# Altium project BSPD.PrjPcb
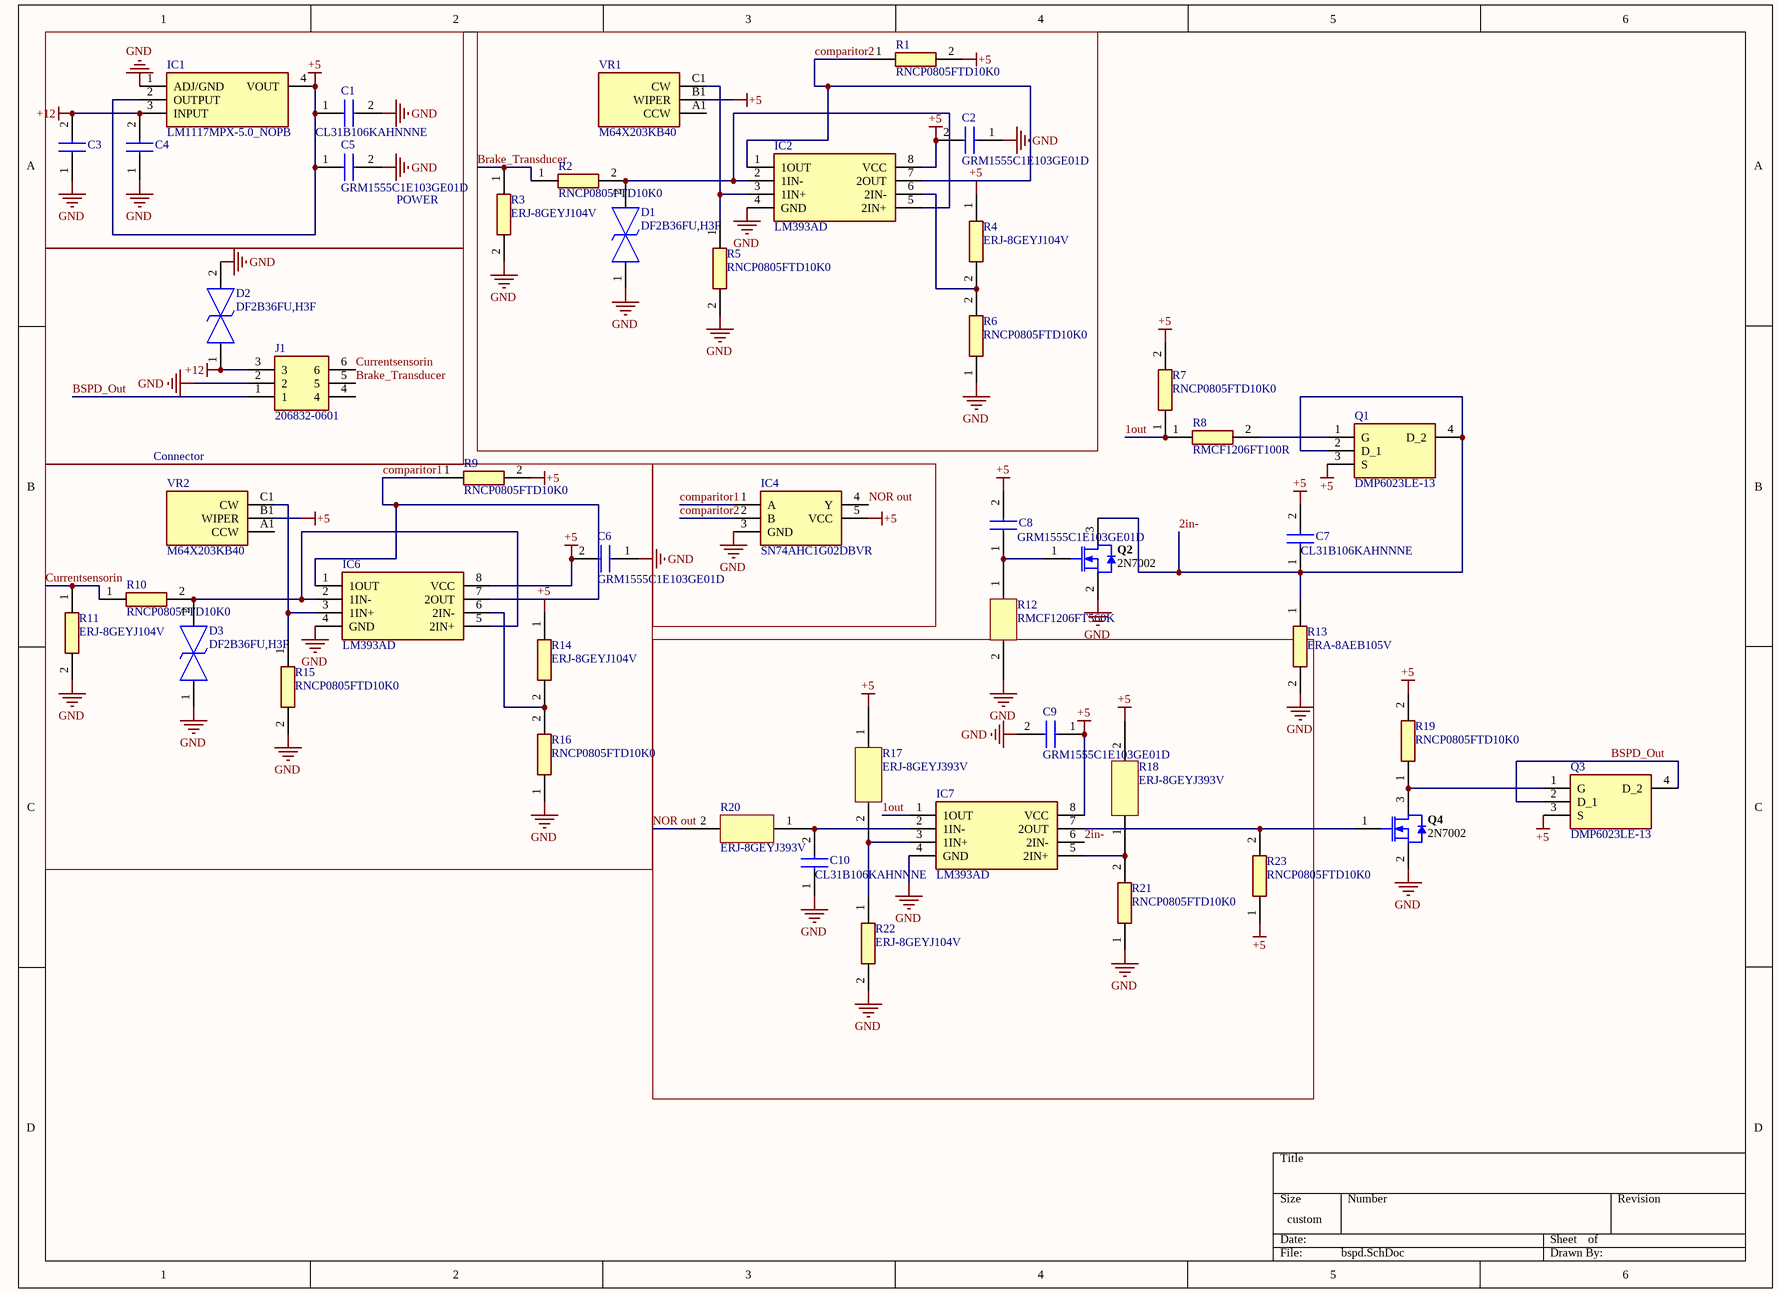
[diagram p0: bspd.SchDoc]
1 sheet, 48 parts. Net scope: global (net labels, ports and power ports of the same name join across sheets).
Board file: BSPD.PcbDoc

## Sheet bspd.SchDoc
size 330 x 241 mm; SheetNumber: 1; SheetTotal: 1

### Parts
C1  CL31B106KAHNNNE  [CAPC3216X180N]
C2  GRM1555C1E103GE01D  [CAPC1005X55N]
C3  CL31B106KAHNNNE  [CAPC3216X180N]  (value not drawn)
C4  GRM1555C1E103GE01D  [CAPC1005X55N]  (value not drawn)
C5  GRM1555C1E103GE01D  [CAPC1005X55N]
C6  GRM1555C1E103GE01D  [CAPC1005X55N]
C7  CL31B106KAHNNNE  [CAPC3216X180N]
C8  GRM1555C1E103GE01D  [CAPC1005X55N]
C9  GRM1555C1E103GE01D  [CAPC1005X55N]
C10  CL31B106KAHNNNE  [CAPC3216X180N]
D1  DF2B36FU,H3F  [1SS357TPH3F]
D2  DF2B36FU,H3F  [1SS357TPH3F]
D3  DF2B36FU,H3F  [1SS357TPH3F]
IC1  LM1117MPX-5.0_NOPB  [SOT230P700X180-4N]
IC2  LM393AD  [SOIC127P600X175-8N]
IC4  SN74AHC1G02DBVR  [SOT95P280X145-5N]
IC6  LM393AD  [SOIC127P600X175-8N]
IC7  LM393AD  [SOIC127P600X175-8N]
J1  206832-0601  [2068320601]
Q1  DMP6023LE-13  [SOT230P700X165-4N]
Q2  2N7002  [INF-PG-SOT23_M]
Q3  DMP6023LE-13  [SOT230P700X165-4N]
Q4  2N7002  [INF-PG-SOT23_M]
R1  RNCP0805FTD10K0  [RESC2012X65N]
R2  RNCP0805FTD10K0  [RESC2012X65N]
R3  ERJ-8GEYJ104V  [RESC3116X70N]
R4  ERJ-8GEYJ104V  [RESC3116X70N]
R5  RNCP0805FTD10K0  [RESC2012X65N]
R6  RNCP0805FTD10K0  [RESC2012X65N]
R7  RNCP0805FTD10K0  [RESC2012X65N]
R8  RMCF1206FT100R  [RESC3216X70N]
R9  RNCP0805FTD10K0  [RESC2012X65N]
R10  RNCP0805FTD10K0  [RESC2012X65N]
R11  ERJ-8GEYJ104V  [RESC3116X70N]
R12  RMCF1206FT560K  [RMCF1206FT560K]
R13  ERA-8AEB105V  [ERA8A_(0805)]
R14  ERJ-8GEYJ104V  [RESC3116X70N]
R15  RNCP0805FTD10K0  [RESC2012X65N]
R16  RNCP0805FTD10K0  [RESC2012X65N]
R17  ERJ-8GEYJ393V  [ERJ-8GEYJ393V]
R18  ERJ-8GEYJ393V  [ERJ-8GEYJ393V]
R19  RNCP0805FTD10K0  [RESC2012X65N]
R20  ERJ-8GEYJ393V  [ERJ-8GEYJ393V]
R21  RNCP0805FTD10K0  [RESC2012X65N]
R22  ERJ-8GEYJ104V  [RESC3116X70N]
R23  RNCP0805FTD10K0  [RESC2012X65N]
VR1  M64X203KB40  [M64X203KB40]
VR2  M64X203KB40  [M64X203KB40]

### Blocks framed on the sheet
POWER: C1 C3-C5 IC1
Connector: D2 J1

### Nets
+5: C1.1 C2.2 C5.1 C6.2 C7.2 C8.2 C9.1 IC1.2(OUTPUT) IC1.4(VOUT) IC2.8(VCC) IC4.5(VCC) IC6.8(VCC) IC7.8(VCC) Q1.3(S) Q3.3(S) R1.2 R4.1 R7.2 R9.2 R14.1 R17.1 R18.2 R19.2 R23.1 VR1.B1(WIPER) VR2.B1(WIPER)
+12: C3.2 C4.2 D2.1 IC1.3(INPUT) J1.3
GND: C1.2 C2.1 C3.1 C4.1 C5.2 C6.1 C9.2 C10.1 D1.1 D2.2 D3.1 IC1.1(ADJ/GND) IC2.4(GND) IC4.3(GND) IC6.4(GND) IC7.4(GND) J1.2 Q2.2(SOURCE) Q4.2(SOURCE) R3.2 R5.2 R6.1 R11.2 R12.2 R13.2 R15.2 R16.1 R21.1 R22.2
1out: IC7.1(1OUT) R7.1 R8.1
2in-: C7.1 IC7.6(2IN-) Q1.2(D_1) Q1.4(D_2) Q2.3(DRAIN) R13.1
Brake_Transducer: J1.5 R2.1 R3.1
BSPD_Out: J1.1 Q3.2(D_1) Q3.4(D_2)
comparitor1: IC4.1(A) IC6.1(1OUT) IC6.7(2OUT) R9.1
comparitor2: IC2.1(1OUT) IC2.7(2OUT) IC4.2(B) R1.1
Currentsensorin: J1.6 R10.1 R11.1
NOR out: IC4.4(Y) R20.2
NetC8_1: C8.1 Q2.1(GATE) R12.1
NetC10_2: C10.2 IC7.2(1IN-) R20.1
NetD1_2: D1.2 IC2.2(1IN-) IC2.5(2IN+) R2.2
NetD3_2: D3.2 IC6.2(1IN-) IC6.5(2IN+) R10.2
NetIC2_3: IC2.3(1IN+) R5.1 VR1.C1(CW)
NetIC2_6: IC2.6(2IN-) R4.2 R6.2
NetIC6_3: IC6.3(1IN+) R15.1 VR2.C1(CW)
NetIC6_6: IC6.6(2IN-) R14.2 R16.2
NetIC7_3: IC7.3(1IN+) R17.2 R22.1
NetIC7_5: IC7.5(2IN+) R18.1 R21.2
NetIC7_7: IC7.7(2OUT) Q4.1(GATE) R23.2
NetQ1_1: Q1.1(G) R8.2
NetQ3_1: Q3.1(G) Q4.3(DRAIN) R19.1

Not connected (* = marked no-connect by the designer): J1 4; VR1 A1(CCW); VR2 A1(CCW)

### Library data of the parts
C1 C3 C7 C10 = CL31B106KAHNNNE: Capacitor; Manufacturer_Name: Samsung Electro-Mechanics; Datasheet Link: https://datasheet.datasheetarchive.com/originals/distributors/Datasheets_SAMA/d94547340e0e9d2be5f415b64e4e2f0a.pdf; Height: 1.8mm; Manufacturer_Part_Number: CL31B106KAHNNNE; Mouser Part Number: 187-CL31B106KAHNNNE; Mouser Price/Stock: https://www.mouser.co.uk/ProductDetail/Samsung-Electro-Mechanics/CL31B106KAHNNNE?qs=349EhDEZ59r5EZhnLOTsYA%3D%3D; Arrow Part Number: CL31B106KAHNNNE; Arrow Price/Stock: https://www.arrow.com/en/products/cl31b106kahnnne/samsung-electro-mechanics?region=europe
C2 C4-C6 C8 C9 = GRM1555C1E103GE01D: Capacitor; Manufacturer_Name: Murata Electronics; Datasheet Link: http://www.murata.com/~/media/webrenewal/support/library/catalog/products/capacitor/mlcc/c02e.pdf; Height: 0.55mm; Manufacturer_Part_Number: GRM1555C1E103GE01D; Mouser Part Number: 81-GRM1555C1E103GE1D; Mouser Price/Stock: https://www.mouser.co.uk/ProductDetail/Murata-Electronics/GRM1555C1E103GE01D?qs=d0WKAl%252BL4KYoPP5%252BcWf4LA%3D%3D
D1-D3 = DF2B36FU,H3F: TVS Diode (Bi-directional); Manufacturer_Name: Toshiba; Datasheet Link: http://toshiba.semicon-storage.com/info/docget.jsp?did=36248&prodName=DF2B36FU; Height: 1mm; Manufacturer_Part_Number: DF2B36FU,H3F; Mouser Part Number: 757-DF2B36FUH3F; Mouser Price/Stock: https://www.mouser.co.uk/ProductDetail/Toshiba/DF2B36FUH3F?qs=PDgMCp4xDJY7HvoH3U6rfA%3D%3D; Arrow Part Number: DF2B36FU,H3F; Arrow Price/Stock: https://www.arrow.com/en/products/df2b36fuh3f/toshiba?region=nac
IC1 = LM1117MPX-5.0_NOPB: Integrated Circuit; Manufacturer_Name: Texas Instruments; Manufacturer_Part_Number: LM1117MPX-5.0/NOPB; Datasheet Link: http://www.ti.com/lit/gpn/lm1117; Height: 1.8mm; Mouser Part Number: 926-LM1117MPX5.0NOPB; Mouser Price/Stock: https://www.mouser.co.uk/ProductDetail/Texas-Instruments/LM1117MPX-5.0-NOPB?qs=X1J7HmVL2ZE1O12Qsl7F9g%3D%3D; Arrow Part Number: LM1117MPX-5.0/NOPB; Arrow Price/Stock: https://www.arrow.com/en/products/lm1117mpx-5.0nopb/texas-instruments?region=nac
IC2 IC6 IC7 = LM393AD: Integrated Circuit; Manufacturer_Name: Texas Instruments; Datasheet Link: http://www.ti.com/lit/ds/symlink/lm393a.pdf; Height: 1.75mm; Manufacturer_Part_Number: LM393AD; Mouser Part Number: 595-LM393AD; Mouser Price/Stock: https://www.mouser.co.uk/ProductDetail/Texas-Instruments/LM393AD?qs=LfG3tU9ud8Dw2sg2xFhQ4Q%3D%3D; Arrow Part Number: LM393AD; Arrow Price/Stock: https://www.arrow.com/en/products/lm393ad/texas-instruments?region=nac
IC4 = SN74AHC1G02DBVR: Integrated Circuit; Manufacturer_Name: Texas Instruments; Datasheet Link: http://www.ti.com/lit/gpn/sn74ahc1g02; Height: 1.45mm; Manufacturer_Part_Number: SN74AHC1G02DBVR; Mouser Part Number: 595-SN74AHC1G02DBVR; Mouser Price/Stock: https://www.mouser.co.uk/ProductDetail/Texas-Instruments/SN74AHC1G02DBVR?qs=VuX40u8tcuDWJaATLLYZCQ%3D%3D; Arrow Part Number: SN74AHC1G02DBVR; Arrow Price/Stock: https://www.arrow.com/en/products/sn74ahc1g02dbvr/texas-instruments
J1 = 206832-0601: Connector; Manufacturer_Name: Molex; Datasheet Link: https://componentsearchengine.com/Datasheets/1/206832-0601.pdf; Height: 10.99mm; Manufacturer_Part_Number: 206832-0601; Mouser Part Number: 538-206832-0601; Mouser Price/Stock: https://www.mouser.co.uk/ProductDetail/Molex/206832-0601?qs=EBDBlbfErPyv6tUvq0oX3w%3D%3D
Q1 Q3 = DMP6023LE-13: MOSFET (P-Channel); Manufacturer_Name: Diodes Inc.; Datasheet Link: https://www.diodes.com/assets/Datasheets/DMP6023LE.pdf; Height: 1.65mm; Manufacturer_Part_Number: DMP6023LE-13; Mouser Part Number: 621-DMP6023LE-13; Mouser Price/Stock: https://www.mouser.co.uk/ProductDetail/Diodes-Incorporated/DMP6023LE-13?qs=jXf%2FRVhl83aBpRq%2FTUDEyw%3D%3D; Arrow Part Number: DMP6023LE-13; Arrow Price/Stock: https://www.arrow.com/en/products/dmp6023le-13/diodes-incorporated?region=nac
Q2 Q4 = CMP-1149-00026-1: N-Channel OptiMOS Small-Signal-Transistor, 60 V VDS, 0.3 A ID, -55 to 150 degC, PG-SOT23, Reel, Green; Manufacturer: Infineon; RDS (on) (max) (@4.5V): 4,000 mOhm; VDS (max): 60 V; IDpuls (max): 1.2Â A; QG: 0.4Â nC; RDS (on) (max): 3,000 mOhm; RthJA (max): 250 K/W; ID (max): 0.3Â A; VGS(th) (max): 2.5Â V; VGS(th) (min): 1.5Â V; Green: TRUE; Ptot (max): 0.5Â W; PackageDescription: 3-Pin Small Outline Transistor Package, 2.9 x 1.3 mm Body, 0.95 mm Pitch; Halogen-free: TRUE; ComponentLink2Description: Datasheet; ComponentLink1URL: http://www.infineon.com/; Packing: Reel; DatasheetVersion: Rev. 2.4; PartNumber: 2N7002; PackageReference: PG-SOT23; PackageVersion: Apr-08; ComponentLink3URL: http://www.infineon.com/dgdl/SOT23-Package_Overview.pdf?folderId=db3a30431936bc4b0119532290053c66&fileId=db3a30431936bc4b0119533468123c85; ComponentLink1Description: Manufacturer URL; Mounting Technology: Surface Mount; ComponentLink3Description: Package Specification; ComponentLink2URL: http://www.infineon.com/dgdl/2N7002_Rev2.4.pdf?folderId=db3a3043156fd573011622e10b5c1f67&fileId=db3a304319bc939a0119c2a9461e79e6
R1 R2 R5-R7 R9 R10 R15 R16 R19 R21 R23 = RNCP0805FTD10K0: Resistor; Manufacturer_Name: Stackpole Electronics; Datasheet Link: https://cs.seielect.com/catalog/SEI-RNCP.pdf; Height: 0.65mm; Manufacturer_Part_Number: RNCP0805FTD10K0; Arrow Part Number: RNCP0805FTD10K0; Arrow Price/Stock: https://www.arrow.com/en/products/rncp0805ftd10k0/stackpole-electronics?region=nac
R3 R4 R11 R14 R22 = ERJ-8GEYJ104V: Resistor; Manufacturer_Name: Panasonic; Datasheet Link: http://industrial.panasonic.com/www-cgi/jvcr13pz.cgi?E+PZ+3+AOA0001+ERJ8GEYJ104V+7+WW; Height: 0.7mm; Manufacturer_Part_Number: ERJ-8GEYJ104V; Mouser Part Number: 667-ERJ-8GEYJ104V; Mouser Price/Stock: https://www.mouser.co.uk/ProductDetail/Panasonic/ERJ-8GEYJ104V?qs=1VWA5LkbEaq%252BpFGvVNqM0w%3D%3D; Arrow Part Number: ERJ-8GEYJ104V; Arrow Price/Stock: https://www.arrow.com/en/products/erj-8geyj104v/panasonic?region=nac
R8 = RMCF1206FT100R: Resistor; Manufacturer_Name: Stackpole Electronics; Datasheet Link: https://cs.seielect.com/catalog/SEI-RMCF_RMCP.pdf; Height: 0.7mm; Manufacturer_Part_Number: RMCF1206FT100R; Arrow Part Number: RMCF1206FT100R; Arrow Price/Stock: https://www.arrow.com/en/products/rmcf1206ft100r/stackpole-electronics
R12 = RMCF1206FT560K: 560k smd 1/4 w resistor
R13 = ERA-8AEB105V: Resistor; Manufacturer_Name: Panasonic; Datasheet Link: http://industrial.panasonic.com/cdbs/www-data/pdf/RDM0000/AOA0000C307.pdf; Height: 0.7mm; Manufacturer_Part_Number: ERA-8AEB105V; Mouser Part Number: 667-ERA-8AEB105V; Mouser Price/Stock: https://www.mouser.com/Search/Refine.aspx?Keyword=667-ERA-8AEB105V
VR1 VR2 = M64X203KB40: Variable Resistor; Manufacturer_Name: Vishay; Datasheet Link: https://componentsearchengine.com/Datasheets/1/M64X203KB40.pdf; Height: 9.8mm; Manufacturer_Part_Number: M64X203KB40; Mouser Part Number: 594-64X203; Mouser Price/Stock: https://www.mouser.co.uk/ProductDetail/Vishay-Spectrol/M64X203KB40?qs=iBCKGqwqm%252Bj9keWMEvhABw%3D%3D; Arrow Part Number: M64X203KB40; Arrow Price/Stock: https://www.arrow.com/en/products/m64x203kb40/vishay